# EAGLE schematic pcb (EAGLE 8.0.2)

## Sheet 1 of 2
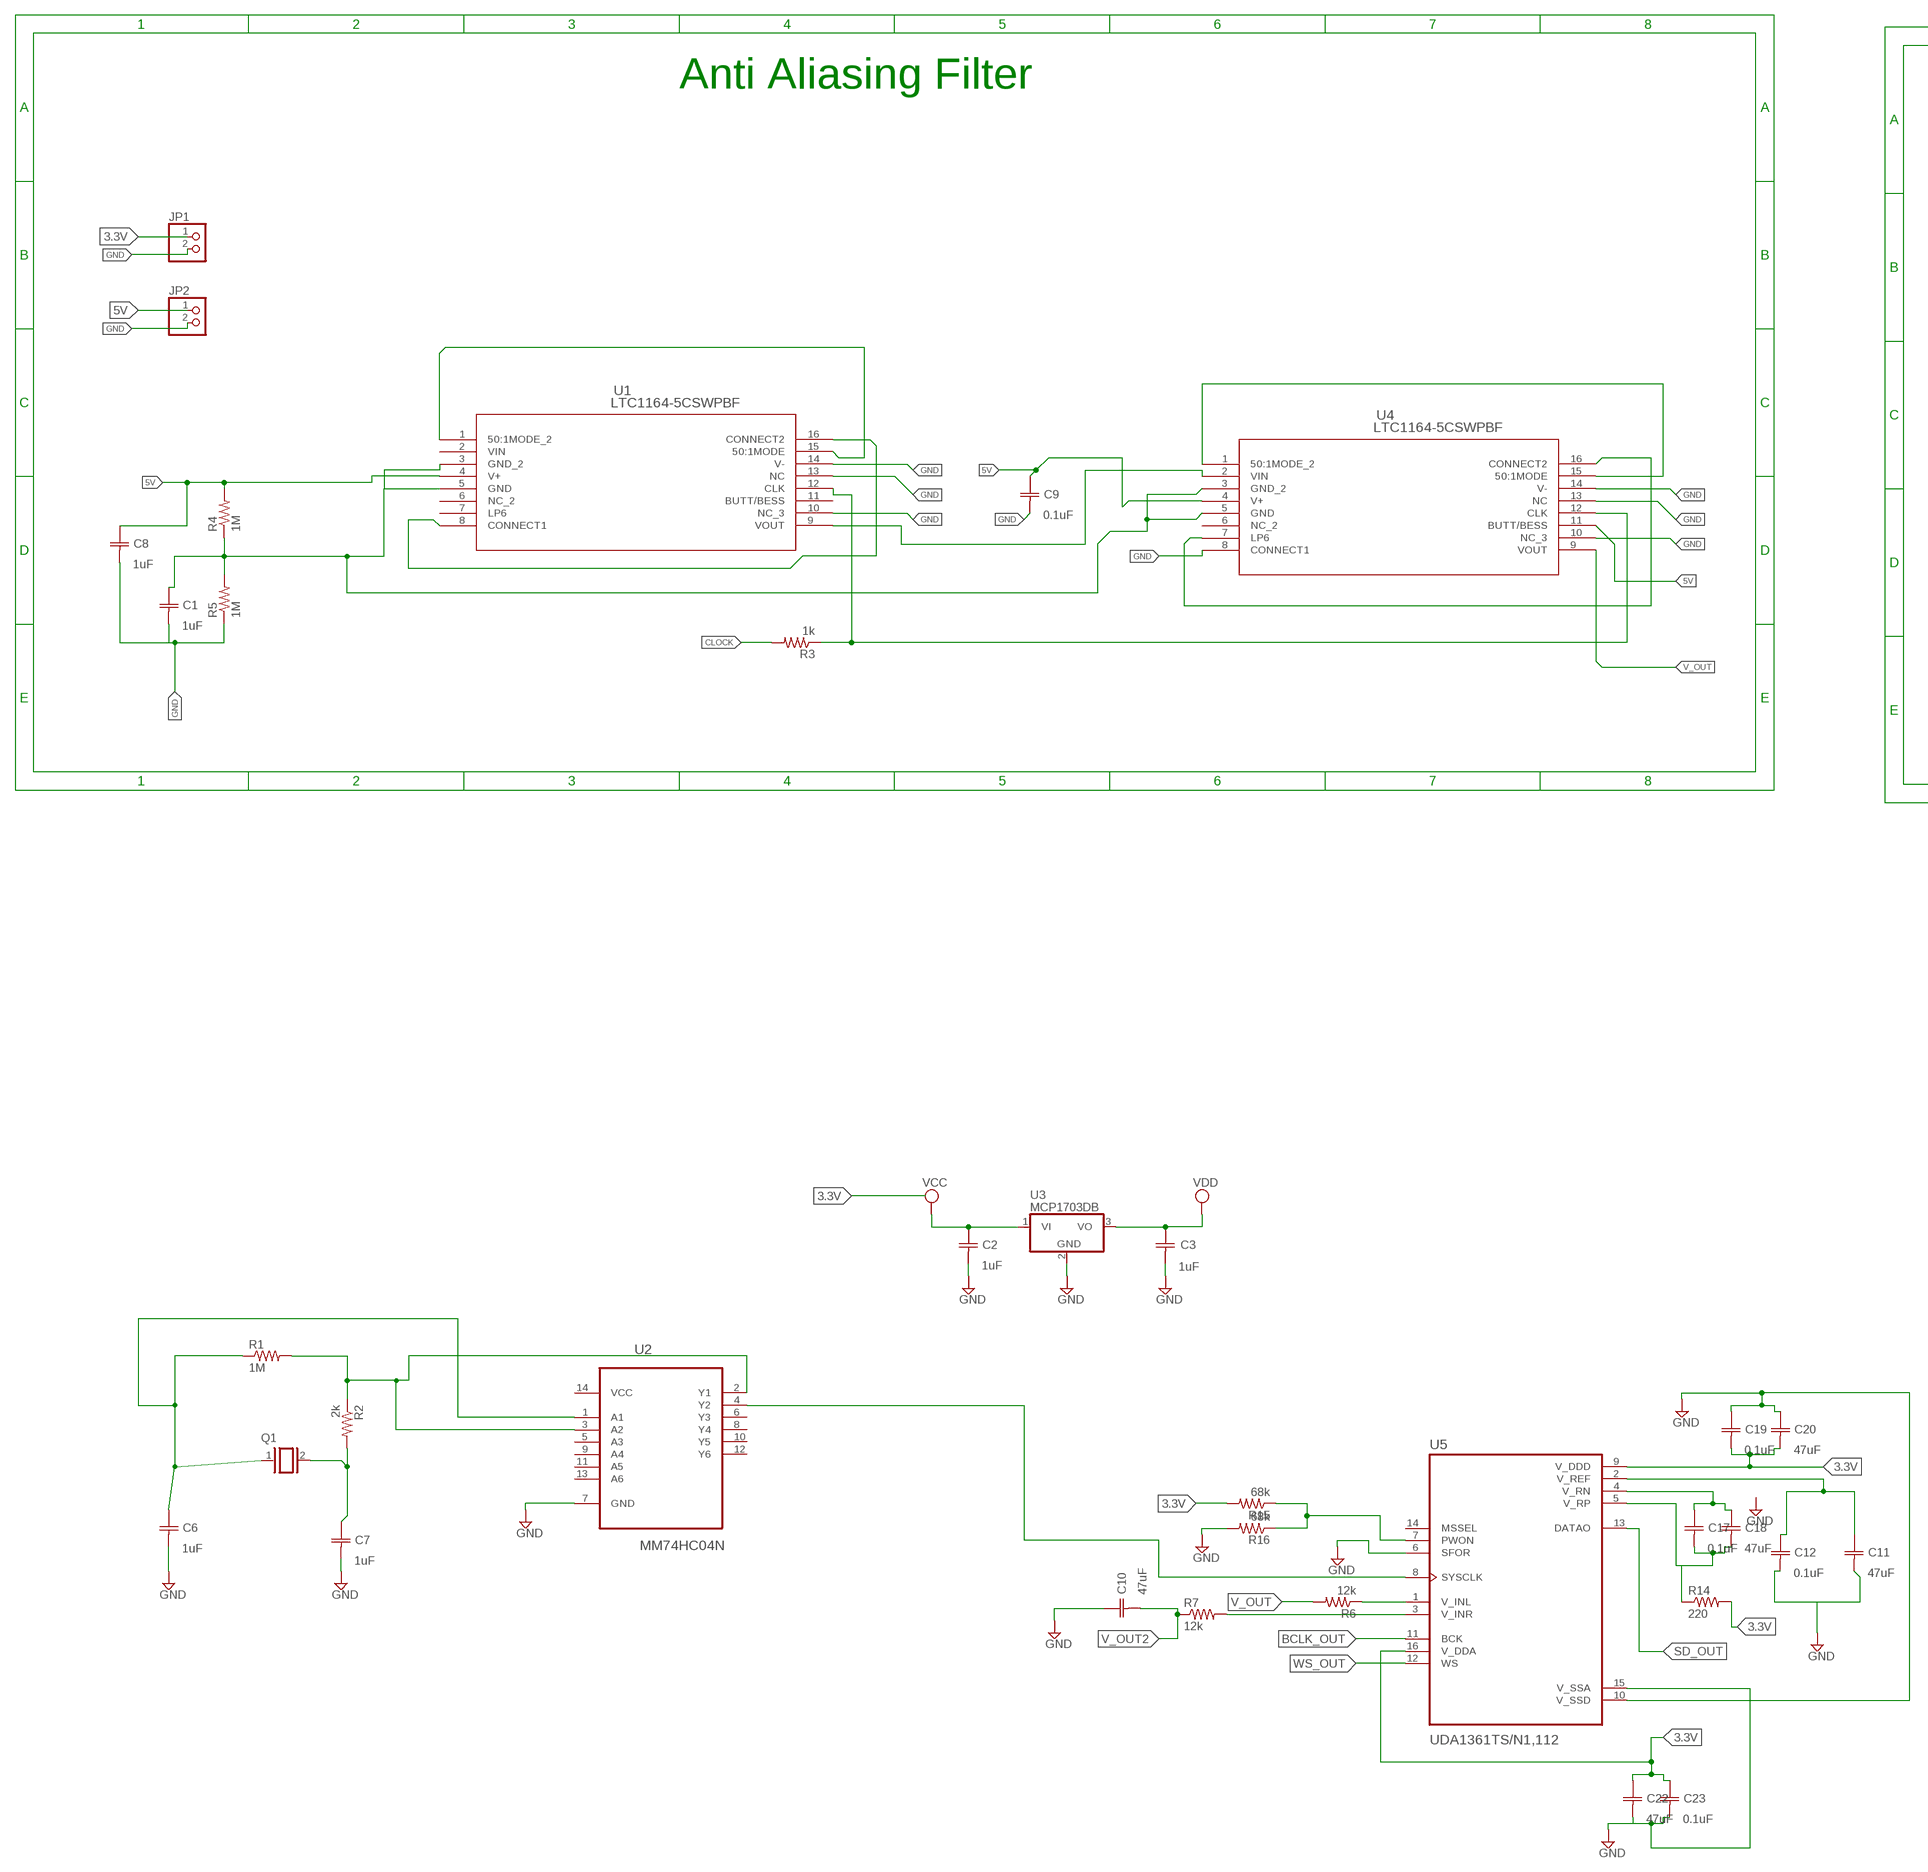
[diagram p0: schematic, sheet 1, part 1 of 2]
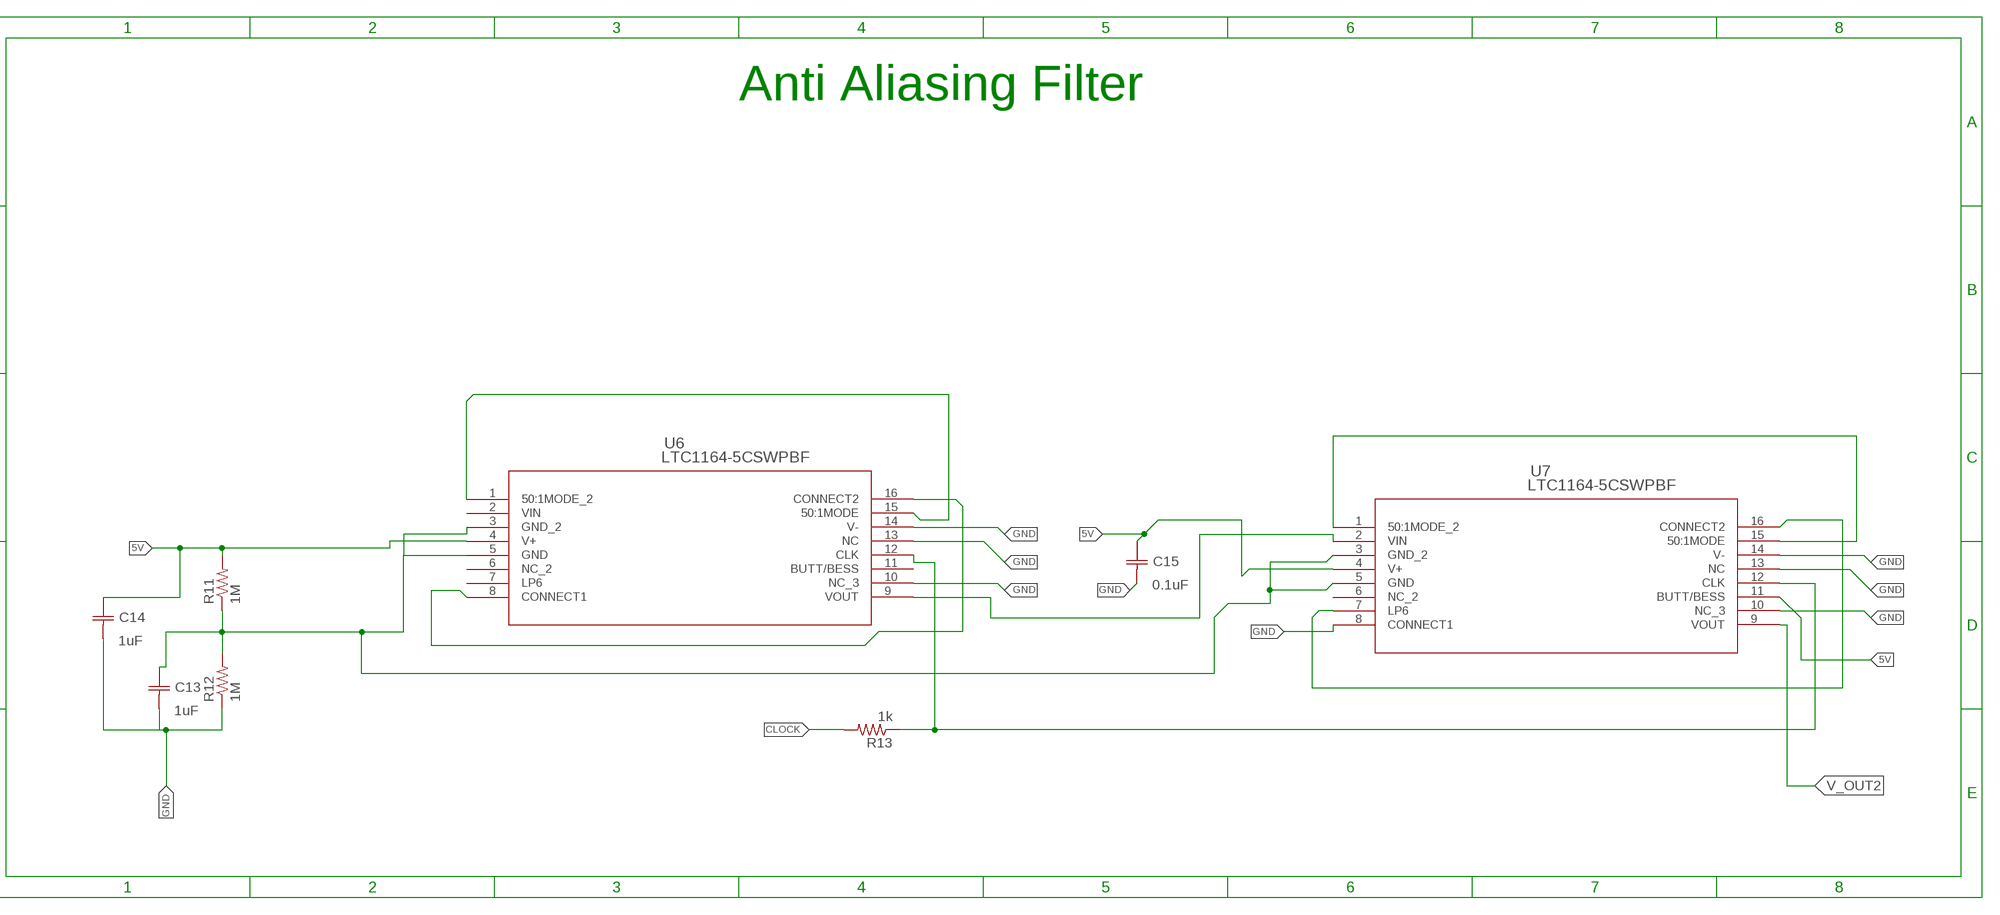
[diagram p1: schematic, sheet 1, part 2 of 2]

### Parts
C1  1uF  C0805C105K3RACTU  [CAPC2013X140N]
C2  1uF  C0805C105K3RACTU  [CAPC2013X140N]
C3  1uF  C0805C105K3RACTU  [CAPC2013X140N]
C6  1uF  C0805C105K3RACTU  [CAPC2013X140N]
C7  1uF  C0805C105K3RACTU  [CAPC2013X140N]
C8  1uF  C0805C105K3RACTU  [CAPC2013X140N]
C9  0.1uF  C0805C105K3RACTU  [CAPC2013X140N]
C10  47uF  C0805C105K3RACTU  [CAPC2013X140N]
C11  47uF  C0805C105K3RACTU  [CAPC2013X140N]
C12  0.1uF  C0805C105K3RACTU  [CAPC2013X140N]
C13  1uF  C0805C105K3RACTU  [CAPC2013X140N]
C14  1uF  C0805C105K3RACTU  [CAPC2013X140N]
C15  0.1uF  C0805C105K3RACTU  [CAPC2013X140N]
C17  0.1uF  C0805C105K3RACTU  [CAPC2013X140N]
C18  47uF  C0805C105K3RACTU  [CAPC2013X140N]
C19  0.1uF  C0805C105K3RACTU  [CAPC2013X140N]
C20  47uF  C0805C105K3RACTU  [CAPC2013X140N]
C22  47uF  C0805C105K3RACTU  [CAPC2013X140N]
C23  0.1uF  C0805C105K3RACTU  [CAPC2013X140N]
JP1  PINHD-1X2  [1X02]
JP2  PINHD-1X2  [1X02]
Q1  XTAL/S  [QS]
R1  1M  R-US_R0805  [R0805]
R2  2k  R-US_R0805  [R0805]
R3  1k  R-US_R0805  [R0805]
R4  1M  R-US_R0805  [R0805]
R5  1M  R-US_R0805  [R0805]
R6  12k  R-US_R0805  [R0805]
R7  12k  R-US_R0805  [R0805]
R11  1M  R-US_R0805  [R0805]
R12  1M  R-US_R0805  [R0805]
R13  1k  R-US_R0805  [R0805]
R14  220  R-US_R0805  [R0805]
R15  68k  R-US_R0805  [R0805]
R16  68k  R-US_R0805  [R0805]
U1  LTC1164-5CSWPBF  [SO-16_SW]
U2  MM74HC04N  [DIP254P762X533-14]
U3  MCP1703DB  [SOT223]
U4  LTC1164-5CSWPBF  [SO-16_SW]
U5  UDA1361TS/N1,112  [SOP65P640X120-16N]
U6  LTC1164-5CSWPBF  [SO-16_SW]
U7  LTC1164-5CSWPBF  [SO-16_SW]

### Nets
3.3V: C19.2(C2) C20.2(C2) C22.1(C1) C23.1(C1) JP1.1 R14.2 R15.2 U5.9(V_DDD) U5.16(V_DDA)
5V: C8.1(C1) C9.1(C1) C14.1(C1) C15.1(C1) JP2.1 R4.2 R11.2 U1.4(V+) U4.4(V+) U4.11(BUTT/BESS) U6.4(V+) U7.4(V+) U7.11(BUTT/BESS)
BCLK_OUT: U5.11(BCK)
CLOCK: R3.2 R13.2
GND: C1.2(C2) C2.2(C2) C3.2(C2) C6.2(C2) C7.2(C2) C8.2(C2) C9.2(C2) C10.1(C1) C11.2(C2) C12.2(C2) C13.2(C2) C14.2(C2) C15.2(C2) C19.1(C1) C20.1(C1) C22.2(C2) C23.2(C2) R5.1 R12.1 R16.2 U1.13(NC) U1.14(V-) U2.7(GND) U3.2(GND) U4.8(CONNECT1) U4.13(NC) U4.14(V-) U5.6(SFOR) U5.10(V_SSD) U5.15(V_SSA) U6.13(NC) U6.14(V-) U7.8(CONNECT1) U7.13(NC) U7.14(V-)
N$1: U1.1(50:1MODE_2) U1.15(50:1MODE)
N$2: R1.2 R2.1 U2.2(Y1) U2.3(A2)
N$3: JP1.2
N$4: C7.1(C1) Q1.2 R2.2
N$5: U1.8(CONNECT1) U1.16(CONNECT2)
N$6: U4.1(50:1MODE_2) U4.15(50:1MODE)
N$7: R3.1 U1.12(CLK) U4.12(CLK)
N$8: JP2.2
N$9: U1.9(VOUT) U4.2(VIN)
N$10: U4.7(LP6) U4.16(CONNECT2)
N$11: R6.1 U5.1(V_INL)
N$12: C1.1(C1) R4.1 R5.2 U1.3(GND_2) U1.5(GND) U4.3(GND_2) U4.5(GND)
N$13: C11.1(C1) C12.1(C1) U5.2(V_REF)
N$14: U6.1(50:1MODE_2) U6.15(50:1MODE)
N$15: U6.8(CONNECT1) U6.16(CONNECT2)
N$16: C17.1(C1) C18.1(C1) U5.4(V_RN)
N$17: R13.1 U6.12(CLK) U7.12(CLK)
N$18: U7.1(50:1MODE_2) U7.15(50:1MODE)
N$19: U6.9(VOUT) U7.2(VIN)
N$20: U7.7(LP6) U7.16(CONNECT2)
N$21: C13.1(C1) R11.1 R12.2 U6.3(GND_2) U6.5(GND) U7.3(GND_2) U7.5(GND)
N$22: R7.2 U5.3(V_INR)
N$23: C17.2(C2) C18.2(C2) R14.1 U5.5(V_RP)
N$24: R15.1 R16.1 U5.7(PWON)
N$25: U2.4(Y2) U5.8(SYSCLK)
NOT1: C6.1(C1) Q1.1 R1.1 U2.1(A1)
SD_OUT: U5.13(DATAO)
V_OUT: R6.2 U4.9(VOUT)
V_OUT2: C10.2(C2) R7.1 U7.9(VOUT)
VCC: C2.1(C1) U3.1(VI)
VDD: C3.1(C1) U3.3(VO)
WS_OUT: U5.12(WS)
Unconnected: U1.2(VIN) U1.6(NC_2) U1.7(LP6) U1.10(NC_3) U1.11(BUTT/BESS) U2.5(A3) U2.6(Y3) U2.8(Y4) U2.9(A4) U2.10(Y5) U2.11(A5) U2.12(Y6) U2.13(A6) U4.6(NC_2) U4.10(NC_3) U5.14(MSSEL) U6.2(VIN) U6.6(NC_2) U6.7(LP6) U6.10(NC_3) U6.11(BUTT/BESS) U7.6(NC_2) U7.10(NC_3)

### Notes on the sheet
- Anti Aliasing Filter | Anti Aliasing Filter

## Sheet 2 of 2

## Power pins joined to a net without a drawn wire
VCC: U2.14(VCC)

## Library data of the parts
C1-C3 C6-C8 C13 C14 = Kemet_By_element14_Batch_1:C0805C105K3RACTU: CAPACITOR, 0805; MPN: C0805C105K3RACTU; OC_FARNELL: 1637035; OC_NEWARK: 93K6001; SUPPLIER: Kemet; TOLERANCE: ±10%; VOLTAGERATING: 25V
C9-C12 C15 C17-C20 C22 C23 = Kemet_By_element14_Batch_1:C0805C105K3RACTU: CAPACITOR, 0805; MPN: C0805C105K3RACTU; OC_FARNELL: 1637035; OC_NEWARK: 93K6001; SUPPLIER: Kemet; TOLERANCE: ±10%; VALUE: 1uF; VOLTAGERATING: 25V
JP1 JP2 = pinhead:PINHD-1X2: PIN HEADER
Q1 = special:XTAL/S: CRYSTAL
R1-R7 R11-R16 = resistor:R-US_: RESISTOR, American symbol
U1 U4 U6 U7 = LTC1164-5CSWPBF:LTC1164-5CSWPBF; AVAILABILITY: Bad; DESCRIPTION: Ic Filter 8th Ord Lowpass 16soic - Ltc1164-5csw#Pbf; MF: Linear Technology; MP: LTC1164-5CSW#PBF; PACKAGE: SOIC-16 Linear Technology; PRICE: 18.18 USD
U2 = MM74HC04N:MM74HC04N: Hex Inverter; AVAILABILITY: Unavailable; DESCRIPTION: Inverter 6-Element CMOS 14-Pin PDIP W Rail; MF: ON Semiconductor; MP: MM74HC04N; PACKAGE: PDIP-14 ON Semiconductor; PRICE: 0.35 USD
U3 = linear:MCP1703: 250 mA, 16V, Low Quiescent Current LDO Regulator Source: http://ww1.microchip.com/downloads/en/DeviceDoc/22049b.pdf
U5 = UDA1361TS_N1_112:UDA1361TS/N1,112: None; AVAILABILITY: Good; DESCRIPTION: Data acquisition IC - ADC NXP Semiconductors UDA1361TS/N1, 112 24 Bit SSOP 16; MF: NXP Semiconductors; MP: UDA1361TS/N1,112; PACKAGE: SSOP-16 NXP Semiconductors; PRICE: 1.23 USD